# EAGLE design untitled (EAGLE 6.2)
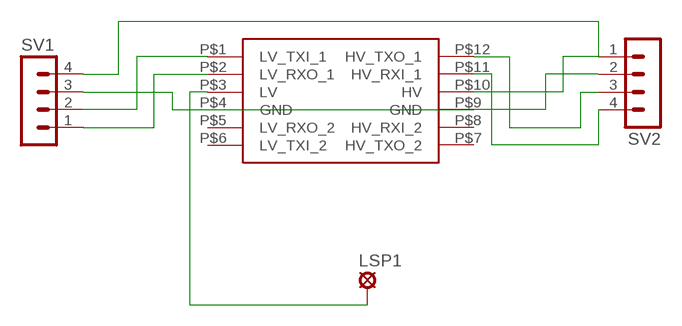
[diagram p0: schematic, sheet 1]

## Parts
LSP1  MCS08  [MCS08]
SV1  MA04-1  [MA04-1]
SV2  MA04-1  [MA04-1]
U$1  LOGIC_LEVEL_CONVERTER  [LOGIC_LEVEL_CONVERTER]

## Nets
GND: SV1.3 SV2.2 U$1.P$4(GND) U$1.P$9(GND)
N$1: SV1.1 U$1.P$2(LV_RXO_1)
N$2: SV1.2 U$1.P$1(LV_TXI_1)
N$4: LSP1.MP U$1.P$3(LV)
N$5: SV1.4 SV2.1 U$1.P$10(HV)
N$7: SV2.3 U$1.P$12(HV_TXO_1)
N$8: SV2.4 U$1.P$11(HV_RXI_1)
Unconnected: U$1.P$5(LV_RXO_2) U$1.P$6(LV_TXI_2) U$1.P$7(HV_TXO_2) U$1.P$8(HV_RXI_2)

## Library data of the parts
LSP1 = solpad:MCS08: SOLDER PAD MC S0,8, drill 1.2 mm, distributor Buerklin, 08F130
SV1 SV2 = con-lstb:MA04-1: PIN HEADER; OC_FARNELL: unknown; OC_NEWARK: unknown
U$1 = SparkFun-Boards:LOGIC_LEVEL_CONVERTER: Logic Level Converter (3.3v - 5v) https://www.sparkfun.com/products/8745

## Board
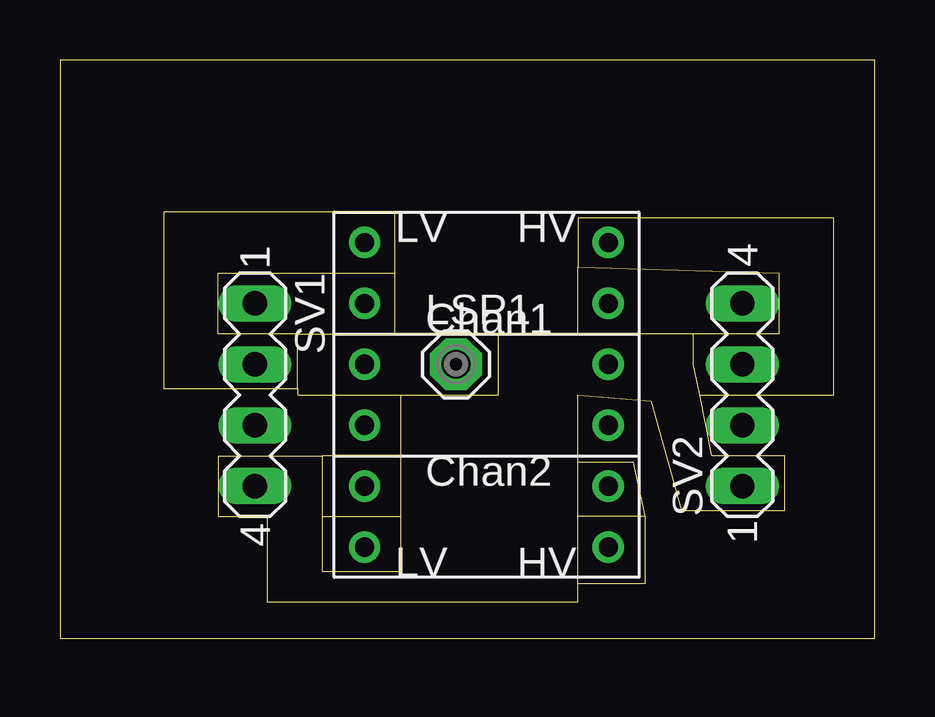
[diagram p1: board, top side]
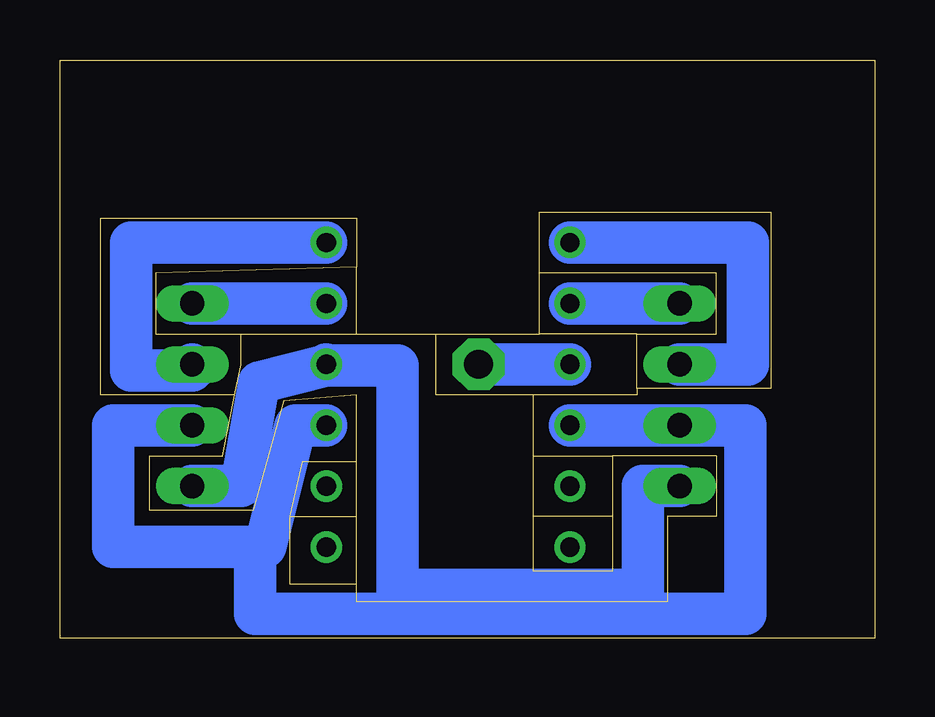
[diagram p2: board, bottom side, seen from below]

Size 33.96 x 24.12 mm. Coordinates in mm from the lower left corner, seen from the top.
Outline: 0,0 33.96,0 33.96,24.12 0,24.12 0,0
Copper layers (1*16): Top 0.035mm / dielectric 1.5mm / Bottom 0.035mm
Design rules: minimum track width 10mil, minimum drill 24mil, track to track 8mil, track to pad 8mil, pad to pad 8mil, via to via 8mil, smd to smd 8mil, copper to edge 40mil, drill to drill 8mil, minimum pad ring 10mil, minimum via ring 8mil, stop-mask expansion 4mil, vias tented up to drill 0mil, thermal gap 10mil
Milling: 55 lines

### Footprints (pad centres in the part's own frame; a part is rotated, then mirrored left to right if it is on the bottom)
MCS08 = drill 1.194 pad 2.159 octagon: MP 0,0
MA04-1 = drill 1.016 long: 1 -3.81,0; 2 -1.27,0; 3 1.27,0; 4 3.81,0
LOGIC_LEVEL_CONVERTER = drill 0.8: P$1 1.27,13.97; P$2 1.27,11.43; P$3 1.27,8.89; P$4 1.27,6.35; P$5 1.27,3.81; P$6 1.27,1.27; P$7 11.43,1.27; P$8 11.43,3.81; P$9 11.43,6.35; P$10 11.43,8.89; P$11 11.43,11.43; P$12 11.43,13.97

### Placement (x,y rotation side)
LSP1  16.51,11.43 0 top
SV1  8.13,10.16 270 top
SV2  28.45,10.16 90 top
U$1  11.43,2.54 0 top

### Tracks (layer width: path | path; a pad name or v marks a point on that pad's centre or on a via)
GND
  Bottom 1.778: U$1.P$9 24.13,8.89 25.4,3.81 25.83,3.81 | 25.83,3.81 31.75,3.81 31.75,8.89 SV2.2 | 25.83,3.81 25.83,1.02 5.38,1.02 5.38,8.89 SV1.3 U$1.P$4
N$1
  Bottom 1.778: SV1.1 U$1.P$2
N$2
  Bottom 1.778: U$1.P$1 5.28,16.51 5.28,11.43 SV1.2
N$4
  Bottom 1.778: U$1.P$3 LSP1.MP
N$5
  Bottom 1.778: SV1.4 9.65,6.35 9.65,2.03 19.89,2.03 19.89,11.38 22.86,11.38 | 22.86,11.38 U$1.P$10 | 22.86,11.38 25.65,10.67 26.42,6.35 SV2.1
N$7
  Bottom 1.778: U$1.P$12 30.99,16.51 30.99,11.18 28.45,11.18 SV2.3
N$8
  Bottom 1.778: U$1.P$11 SV2.4